# EAGLE design CAN-I2C (EAGLE 9.1.1)

## Sheet 1 of 2
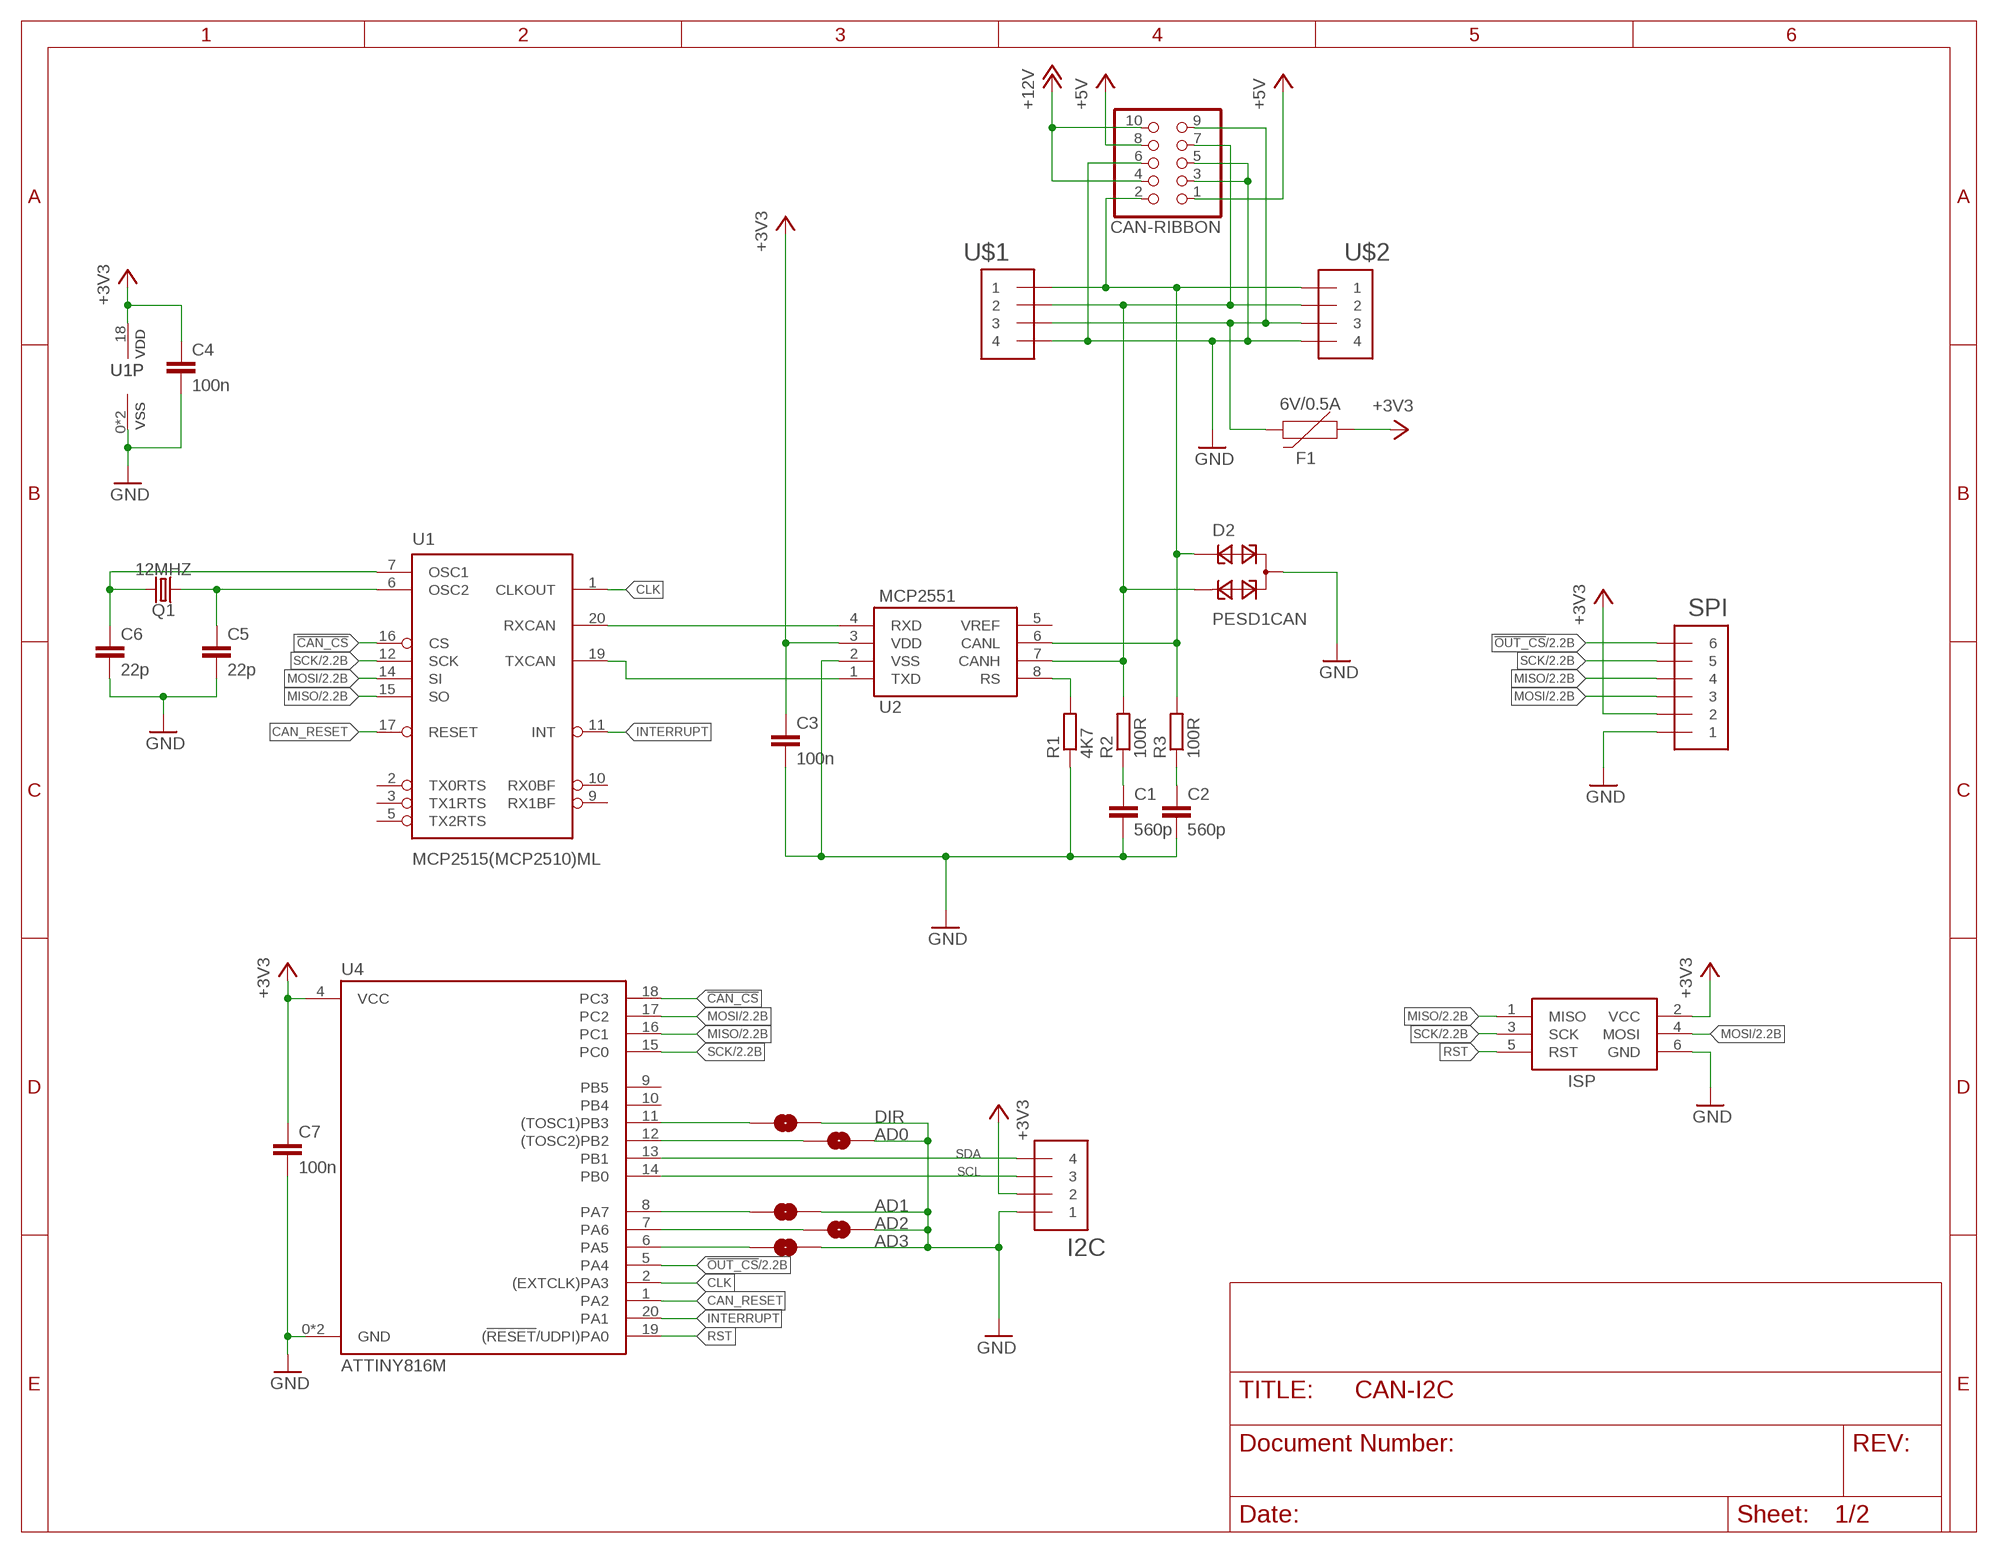
[diagram p0: schematic, sheet 1]

### Parts
AD0  JUMPER-SMT_2_NO_SILK  [SMT-JUMPER_2_NO_SILK]
AD1  JUMPER-SMT_2_NO_SILK  [SMT-JUMPER_2_NO_SILK]
AD2  JUMPER-SMT_2_NO_SILK  [SMT-JUMPER_2_NO_SILK]
AD3  JUMPER-SMT_2_NO_SILK  [SMT-JUMPER_2_NO_SILK]
C1  560p  C-EUC0603  [C0603]
C2  560p  C-EUC0603  [C0603]
C3  100n  C-EUC0603  [C0603]
C4  100n  C-EUC0603  [C0603]
C5  22p  C-EUC0603  [C0603]
C6  22p  C-EUC0603  [C0603]
C7  100n  C-EUC0603  [C0603]
CAN-RIBBON  PINHD-2X5_2.54-SMD  [2X05SMD]
D2  PESD1CAN  [SOT23]
DIR  JUMPER-SMT_2_NO_SILK  [SMT-JUMPER_2_NO_SILK]
F1  6V/0.5A  PPTC_HALF-AMP  [1206]
I2C  STRAWSON_EAGLE_LIB_JST_SH_4  [STRAWSON_EAGLE_LIB_JST_SH_4_SMD]
ISP  AVRISP-6  [AVRISP]
Q1  12MHZ  CRYSTALSMD-3.2X1.5  [CRYSTAL-SMD-3.2X1.5MM]
R1  4K7  R-EU_R0603  [R0603]
R2  100R  R-EU_R0603  [R0603]
R3  100R  R-EU_R0603  [R0603]
SPI  STRAWSON_EAGLE_LIB_JST_SH_6  [STRAWSON_EAGLE_LIB_JST_SH_6]
U1  MCP2515(MCP2510)ML  [QFN20]
U2  MCP2551  [SO08]
U4  ATTINY816M  [QFN20]
U$1  STRAWSON_EAGLE_LIB_JST_SH_4  [STRAWSON_EAGLE_LIB_JST_SH_4_SMD]
U$2  STRAWSON_EAGLE_LIB_JST_SH_4  [STRAWSON_EAGLE_LIB_JST_SH_4_SMD]

### Nets
!CAN_CS!: U1.16(CS) U4.18(PC3)
!OUT_CS!: SPI.6 U4.5(PA4) ; also sheet 2
+3V3: C3.1 C4.1 C7.1 F1.1 I2C.2 ISP.2(VCC) SPI.2 U1.18(VDD) U2.3(VDD) U4.4(VCC) ; also sheet 2
+5V: CAN-RIBBON.1 CAN-RIBBON.8 ; also sheet 2
+12V: CAN-RIBBON.4 CAN-RIBBON.10 ; also sheet 2
CAN_RESET: U1.17(RESET) U4.1(PA2)
CLK: U1.1(CLKOUT) U4.2((EXTCLK)PA3)
GND: AD0.2 AD1.2 AD2.2 AD3.2 C1.2 C2.2 C3.2 C4.2 C5.2 C6.2 C7.2 CAN-RIBBON.3 CAN-RIBBON.5 CAN-RIBBON.6 D2.3 DIR.2 I2C.1 ISP.6(GND) R1.1 SPI.1 U1.0(VSS) U1.8(VSS) U2.2(VSS) U4.0(GND) U4.3(GND) U$1.4 U$2.4 ; also sheet 2
INTERRUPT: U1.11(INT) U4.20(PA1)
MISO: ISP.1(MISO) SPI.4 U1.15(SO) U4.16(PC1) ; also sheet 2
MOSI: ISP.4(MOSI) SPI.3 U1.14(SI) U4.17(PC2) ; also sheet 2
N$1: U1.20(RXCAN) U2.4(RXD)
N$2: U1.19(TXCAN) U2.1(TXD)
N$3: R1.2 U2.8(RS)
N$4: CAN-RIBBON.7 D2.2 R2.2 U2.7(CANH) U$1.2 U$2.2
N$5: CAN-RIBBON.2 D2.1 R3.2 U2.6(CANL) U$1.1 U$2.1
N$6: C1.1 R2.1
N$7: C2.1 R3.1
N$8: AD1.1 U4.8(PA7)
N$9: DIR.1 U4.11((TOSC1)PB3)
N$10: C6.1 Q1.P$2 U1.7(OSC1)
N$11: C5.1 Q1.P$1 U1.6(OSC2)
N$12: AD0.1 U4.12((TOSC2)PB2)
N$13: CAN-RIBBON.9 F1.2 U$1.3 U$2.3
N$14: AD2.1 U4.7(PA6)
N$15: AD3.1 U4.6(PA5)
RST: ISP.5(RST) U4.19((!RESET!/UDPI)PA0)
SCK: ISP.3(SCK) SPI.5 U1.12(SCK) U4.15(PC0) ; also sheet 2
SCL: I2C.3 U4.14(PB0) ; also sheet 2
SDA: I2C.4 U4.13(PB1) ; also sheet 2
Unconnected: U1.2(TX0RTS) U1.3(TX1RTS) U1.5(TX2RTS) U1.9(RX1BF) U1.10(RX0BF) U2.5(VREF) U4.9(PB5) U4.10(PB4)

## Sheet 2 of 2
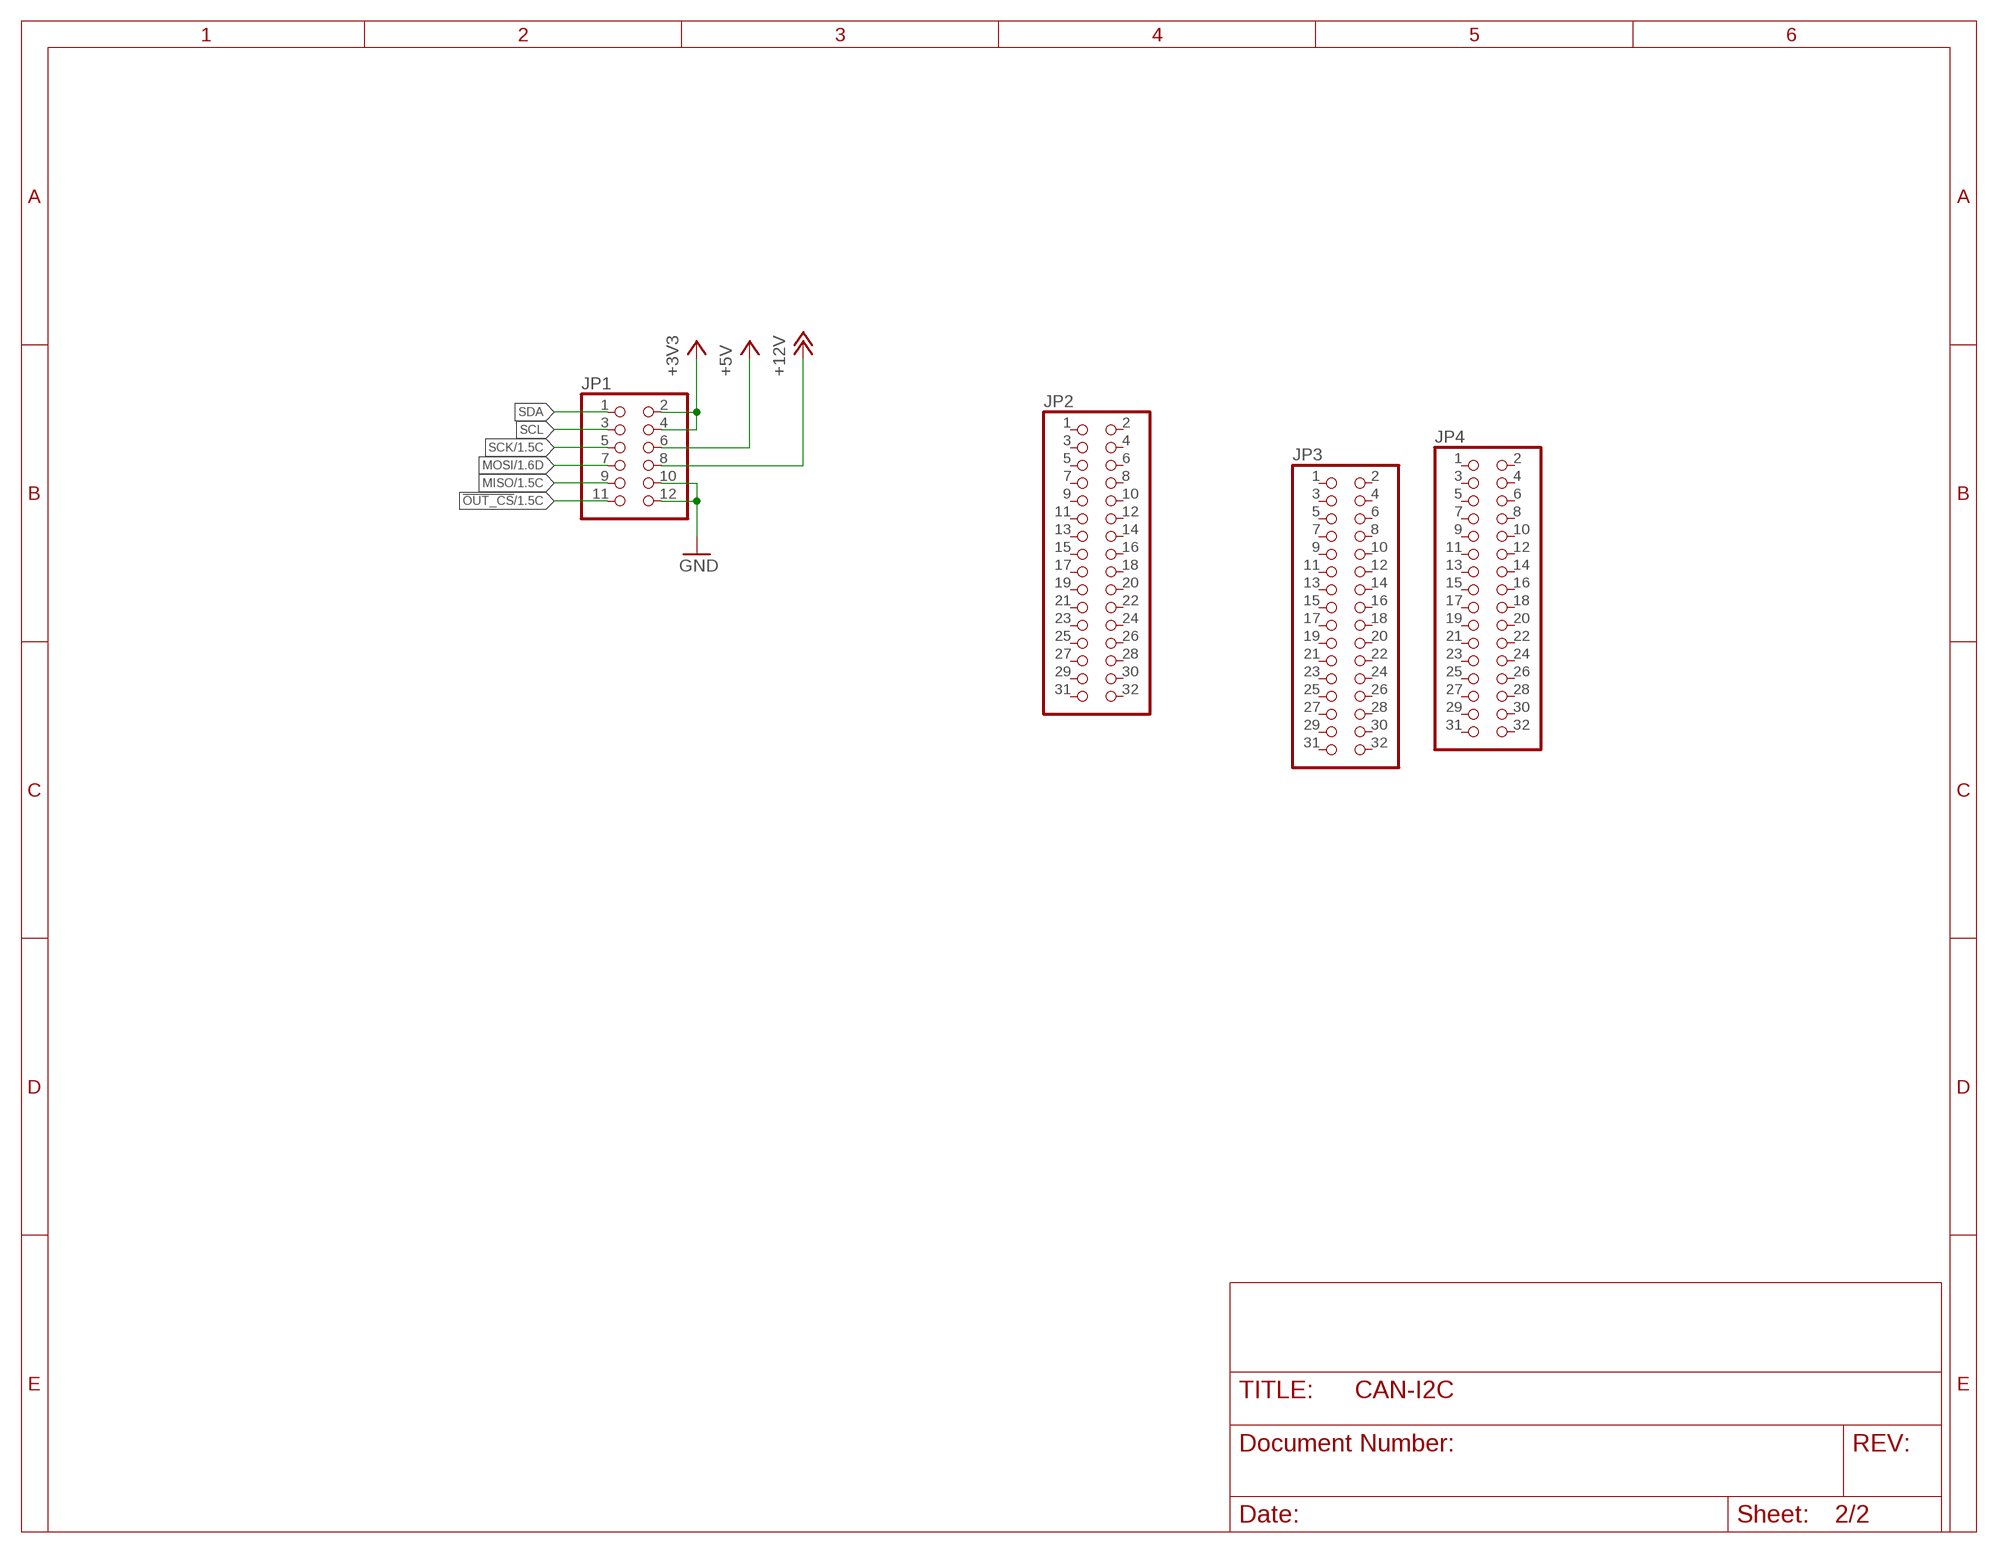
[diagram p1: schematic, sheet 2]

### Parts
JP1  PINHD-2X6  [2X06]
JP2  PINHD-2X16  [2X16]
JP3  PINHD-2X16  [2X16]
JP4  PINHD-2X16  [2X16]

### Nets
!OUT_CS!: JP1.11 ; also sheet 1
+3V3: JP1.2 JP1.4 ; also sheet 1
+5V: JP1.6 ; also sheet 1
+12V: JP1.8 ; also sheet 1
GND: JP1.10 JP1.12 ; also sheet 1
MISO: JP1.9 ; also sheet 1
MOSI: JP1.7 ; also sheet 1
SCK: JP1.5 ; also sheet 1
SCL: JP1.3 ; also sheet 1
SDA: JP1.1 ; also sheet 1
Unconnected: JP2.1 JP2.2 JP2.3 JP2.4 JP2.5 JP2.6 JP2.7 JP2.8 JP2.9 JP2.10 JP2.11 JP2.12 JP2.13 JP2.14 JP2.15 JP2.16 JP2.17 JP2.18 JP2.19 JP2.20 JP2.21 JP2.22 JP2.23 JP2.24 JP2.25 JP2.26 JP2.27 JP2.28 JP2.29 JP2.30 JP2.31 JP2.32 JP3.1 JP3.2 JP3.3 JP3.4 JP3.5 JP3.6 JP3.7 JP3.8 JP3.9 JP3.10 JP3.11 JP3.12 JP3.13 JP3.14 JP3.15 JP3.16 JP3.17 JP3.18 JP3.19 JP3.20 JP3.21 JP3.22 JP3.23 JP3.24 JP3.25 JP3.26 JP3.27 JP3.28 JP3.29 JP3.30 JP3.31 JP3.32 JP4.1 JP4.2 JP4.3 JP4.4 JP4.5 JP4.6 JP4.7 JP4.8 JP4.9 JP4.10 JP4.11 JP4.12 JP4.13 JP4.14 JP4.15 JP4.16 JP4.17 JP4.18 JP4.19 JP4.20 JP4.21 JP4.22 JP4.23 JP4.24 JP4.25 JP4.26 JP4.27 JP4.28 JP4.29 JP4.30 JP4.31 JP4.32

## Library data of the parts
AD0 AD1-AD3 DIR = SparkFun-Jumpers:JUMPER-SMT_2_NO: Normally open jumper This jumper has two pads in close proximity to each other. Apply solder to close the connection. Round pads are easier to solder for beginners, but are a lot larger. SparkFun Product that uses the round pads: SparkFun EL Sequencer <https://www.sparkfun.com/products/12781>
C1-C7 = resistor:C-EU: CAPACITOR, European symbol
CAN-RIBBON = pinhead-1:PINHD-2X5: PIN HEADER
D2 = diode:PESD1CAN: CAN bus ESD protection diode Source: http://www.nxp.com/documents/data_sheet/PESD1CAN.pdf
F1 = SparkFun-Fuses:PPTC: Resettable Fuse PPTC Resettable Fuse. Really a sort of resistor with a polymeric positive temperature coefficient whose resistance increases dramatically with an increase in temperature. When heated by the power passing through the resistance rises causing the current to be limited, protecting the circuit. This is achieved by the transition of the polymer from a crystalline to an amorphous state where the conductive carbon separates breaking the conductive pathways found in the cool crystalline structure. When a PPTC cools back down it resumes conducting letting the circuit turn back on. SparkFun Products: SparkFun RedBoard - Programmed with Arduino <https://www.sparkfun.com/products/12757> Pro Micro - 5V/16MHz <https://www.sparkfun.com/products/12640> Arduino Pro 328 - 5V/16MHz <https://www.sparkfun.com/products/10915> MP3 Trigger <https://www.sparkfun.com/products/13720>; PROD_ID: RES-08585
I2C U$1 U$2 = can-library:STRAWSON_EAGLE_LIB_JST_SH_4
ISP = adafruit:AVRISP: AVR ISP HEADER Standard 6 pin header for AVR programming
JP1 = pinhead:PINHD-2X6: PIN HEADER
JP2-JP4 = pinhead:PINHD-2X16: PIN HEADER
Q1 = SparkFun-Clocks:CRYSTAL: Crystals (Generic) These are passive quartz crystals, which can be used as a clock source for a microcontroller. Crystal's are two-terminal devices. They require external "load" capacitors to generate an oscillating signal.
R1-R3 = resistor:R-EU_: RESISTOR, European symbol
SPI = can-library:STRAWSON_EAGLE_LIB_JST_SH_6
U1 = can-library:MCP2515(MCP2510): CAN controller with SPI interface The MCP2515 controller supercedes the MCP2510 while addressing all errata associated with it. The two devices are pin compatible, either can be used with this device. 18-pin package SOIC Simple SPI interface to any MCU. One-shot mode ensures message transmission is attempted only once Databyte filtering Start-of-Frame (SOF) output Low-power CMOS Technology Datasheet <http://www.sparkfun.com/datasheets/DevTools/Arduino/MCP2515.pdf> SparkFun Products CAN-BUS Shield <https://www.sparkfun.com/products/13262> (DEV-13262)
U2 = SparkFun-IC-Comms:MCP2551: MCP2551 High Speed CAN Transceiver High speed CAN transceiver Datasheet <http://www.sparkfun.com/datasheets/DevTools/Arduino/MCP2551.pdf> SparkFun Products CAN-BUS Shield <https://www.sparkfun.com/products/13262> (DEV-13262) SparkFun OBD-II UART <https://www.sparkfun.com/products/9555> (WIG-09555); PROD_ID: IC-09907
U4 = can-library:ATTINY816

## Board
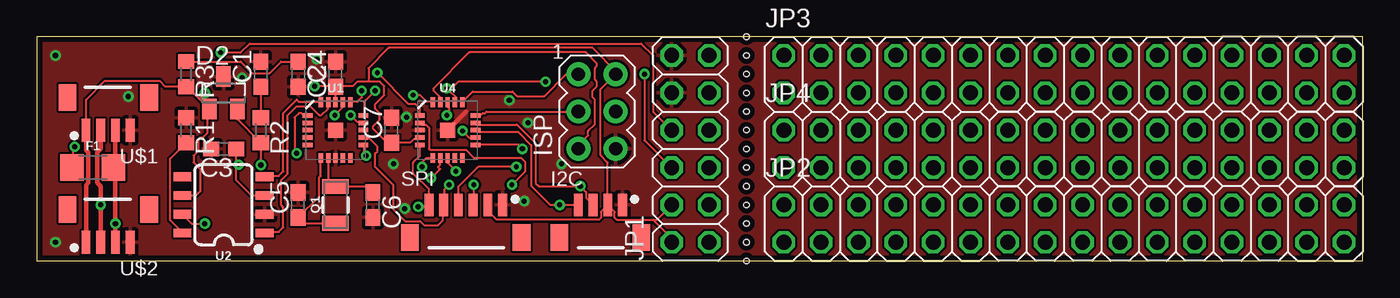
[diagram p2: board, top side]
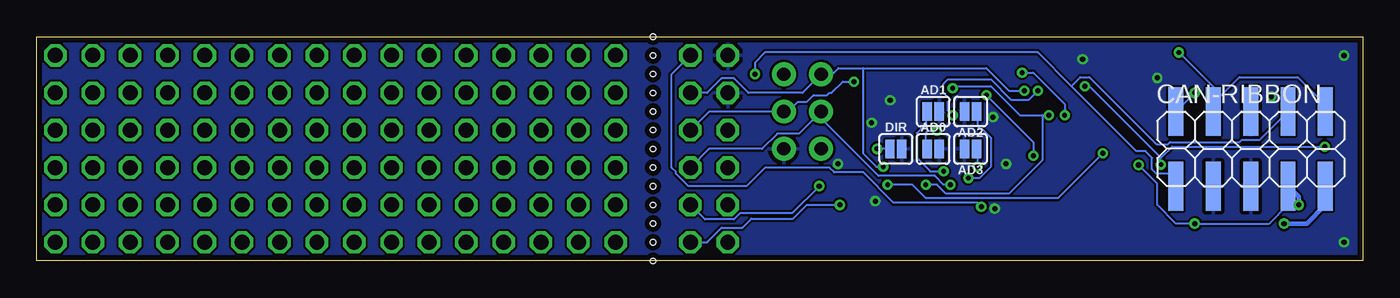
[diagram p3: board, bottom side, seen from below]

Size 90.17 x 15.24 mm. Coordinates in mm from the lower left corner, seen from the top.
Outline: 0,0 90.17,0 90.17,15.24 0,15.24 0,0
Copper layers (1*16): Top 0.0356mm / dielectric 1.5011mm / Bottom 0.0356mm
Design rules "LaenPCBOrder *": minimum track width 6mil, minimum drill 13mil, track to track 6mil, track to pad 6mil, pad to pad 6mil, via to via 6mil, smd to smd 6mil, copper to edge 15mil, drill to drill 6mil, minimum pad ring 7mil, minimum via ring 7mil, stop-mask expansion 4mil, vias tented up to drill 15mil, thermal gap 10mil
Holes 0.35 mm at 48.26,2.54 48.26,3.81 48.26,5.08 48.26,6.35 48.26,7.62 48.26,8.89 48.26,10.16 48.26,11.43 48.26,12.7 48.26,13.97 48.26,15.24 48.26,1.27 48.26,0

### Footprints (pad centres in the part's own frame; a part is rotated, then mirrored left to right if it is on the bottom)
SMT-JUMPER_2_NO_SILK = smd 0.635 x 1.27: 1 -0.406,0; 2 0.406,0
C0603 = smd 1.1 x 1: 1 -0.85,0; 2 0.85,0
2X05SMD = smd 1.016 x 3.302: 1 -1.27,-3.81; 2 -1.27,1.27; 3 1.27,-3.81; 4 1.27,1.27; 5 3.81,-3.81; 6 3.81,1.27; 7 6.35,-3.81; 8 6.35,1.27; 9 8.89,-3.81; 10 8.89,1.27
SOT23 = smd 1 x 1.4: 1 -0.95,-1.1; 2 0.95,-1.1; 3 0,1.1
1206 = smd 1.6 x 1.8: 1 -1.4,0; 2 1.4,0
STRAWSON_EAGLE_LIB_JST_SH_4_SMD = smd 0.6 x 1.55: 1 0.46,1.27; 2 -0.54,1.27; 3 -1.54,1.27; 4 -2.54,1.27 | smd 1.2 x 1.8: P$1 -3.84,-0.955; P$2 1.728,-0.955
AVRISP = drill 0.9 pad 1.626: 1 -1.27,2.54; 2 1.27,2.54; 3 -1.27,0; 4 1.27,0; 5 -1.27,-2.54; 6 1.27,-2.54
2X06 = drill 1.016 octagon: 1 -6.35,-1.27; 2 -6.35,1.27; 3 -3.81,-1.27; 4 -3.81,1.27; 5 -1.27,-1.27; 6 -1.27,1.27; 7 1.27,-1.27; 8 1.27,1.27; 9 3.81,-1.27; 10 3.81,1.27; 11 6.35,-1.27; 12 6.35,1.27
2X16 = drill 1.016 octagon: 1 -19.05,-1.27; 2 -19.05,1.27; 3 -16.51,-1.27; 4 -16.51,1.27; 5 -13.97,-1.27; 6 -13.97,1.27; 7 -11.43,-1.27; 8 -11.43,1.27; 9 -8.89,-1.27; 10 -8.89,1.27; 11 -6.35,-1.27; 12 -6.35,1.27; 13 -3.81,-1.27; 14 -3.81,1.27; 15 -1.27,-1.27; 16 -1.27,1.27; 17 1.27,-1.27; 18 1.27,1.27; 19 3.81,-1.27; 20 3.81,1.27; 21 6.35,-1.27; 22 6.35,1.27; 23 8.89,-1.27; 24 8.89,1.27; 25 11.43,-1.27; 26 11.43,1.27; 27 13.97,-1.27; 28 13.97,1.27; 29 16.51,-1.27; 30 16.51,1.27; 31 19.05,-1.27; 32 19.05,1.27
CRYSTAL-SMD-3.2X1.5MM = smd 1 x 1.8: P$1 -1.25,0; P$2 1.25,0
R0603 = smd 1 x 1.1: 1 -0.85,0; 2 0.85,0
STRAWSON_EAGLE_LIB_JST_SH_6 = smd 0.6 x 1.55: 1 5,0; 2 4,0; 3 3,0; 4 2,0; 5 1,0; 6 0,0 | smd 1.2 x 1.8: P$1 -1.3,-2.225; P$2 6.3,-2.225
QFN20 = smd 1 x 1: 0 0,0 | smd 0.65 x 0.3: 1 -1.9,1; 2 -1.9,0.5; 3 -1.9,0; 4 -1.9,-0.5; 5 -1.9,-1; 11 1.9,-1; 12 1.9,-0.5; 13 1.9,0; 14 1.9,0.5; 15 1.9,1 | smd 0.3 x 0.65: 6 -1,-1.9; 7 -0.5,-1.9; 8 0,-1.9; 9 0.5,-1.9; 10 1,-1.9; 16 1,1.9; 17 0.5,1.9; 18 0,1.9; 19 -0.5,1.9; 20 -1,1.9
SO08 = smd 0.6 x 1.2: 1 -1.905,-2.8; 2 -0.635,-2.8; 3 0.635,-2.8; 4 1.905,-2.8; 5 1.905,2.8; 6 0.635,2.8; 7 -0.635,2.8; 8 -1.905,2.8

### Placement (x,y rotation side)
AD0  29.21,7.62 0 bottom
AD1  29.21,10.16 0 bottom
AD2  26.67,10.16 180 bottom
AD3  26.67,7.62 180 bottom
C1  15.24,12.7 90 top
C2  17.78,12.7 270 top
C3  12.7,7.62 180 top
C4  20.32,12.7 90 top
C5  17.78,3.81 90 top
C6  22.86,3.81 270 top
C7  24.13,8.89 90 top
CAN-RIBBON  11.43,8.89 0 bottom
D2  12.7,11.43 0 top
DIR  31.75,7.62 0 bottom
F1  3.81,6.35 0 top
I2C  39.37,2.54 0 top
ISP  38.1,10.16 0 top
JP1  44.45,7.62 90 top
JP2  69.85,2.54 0 top
JP3  69.85,12.7 0 top
JP4  69.85,7.62 0 top
Q1  20.32,3.81 90 top
R1  10.16,8.89 270 top
R2  15.24,8.89 270 top
R3  10.16,12.7 270 top
SPI  26.67,3.81 0 top
U1  20.32,8.89 0 top
U2  12.7,3.81 90 top
U4  27.94,8.89 0 top
U$1  3.81,10.16 180 top
U$2  3.81,2.54 180 top

### Tracks (layer width: path | path; a pad name or v marks a point on that pad's centre or on a via)
!CAN_CS!  (via drill 0.33)
  Top 0.152: v22.1,11.58 22.1,11.12 21.79,10.82 21.34,10.82 U1.16 | v27.89,9.91 27.89,10.06 28.04,10.21 28.04,10.36 27.89,10.52 27.89,10.67 U4.18
  Bottom 0.152: v22.1,11.58 22.71,10.97 23.93,10.97 25.3,12.34 28.19,12.34 28.5,12.04 28.5,11.43 28.04,10.97 28.19,10.82 28.19,10.21 v27.89,9.91
!OUT_CS!  (via drill 0.35)
  Top 0.152: U4.5 26.06,7.77 26.06,7.16 25.6,6.71 25.6,5.94 26.67,4.88 SPI.6 26.55,3.69 v25.94,3.69
  Bottom 0.152: v25.94,3.69 26.22,3.96 31.9,3.96 33.96,6.02 35.93,6.02 36.26,6.35 40.64,6.35 41.91,5.08 45.85,5.08 46.71,5.94 46.71,6.07 46.99,6.35 46.99,12.7 JP1.11
+3V3  (via drill 0.33)
  Top 0.152: I2C.2 38.83,6.69 38.33,7.19 38.33,11.66 ISP.2 39.47,12.8 37.8,14.48 23.93,14.48 22.55,13.11 22.55,12.19 | SPI.2 30.67,3.41 31.01,3.07 | 31.01,3.07 31.27,2.81 | I2C.2 38.36,3.34 38.36,2.94 38.23,2.81 38.1,2.81 31.27,2.81 | 31.27,2.81 31.01,3.07 | U1.18 C4.1 | U4.4 25.92,8.27 25.62,8.27 25.39,8.04 C7.1 24.08,8.08 23.77,8.08 22.86,8.99 22.86,9.14 23.32,9.6 23.32,10.06 23.01,10.36 23.01,10.67 23.62,11.28 23.62,11.89 23.32,12.19 22.55,12.19 | I2C.2 39.3,3.34 39.3,2.94 39.44,2.81 41.91,2.81 | 13.56,6.55 13.56,5.49 14.63,4.42 15.39,4.42 U2.3 | 13.56,6.55 13.56,7.62 C3.1 | v2.59,7.77 2.44,7.62 2.44,6.4 F1.1 | 13.56,6.55 v13.72,6.55 | 22.55,12.19 21.79,12.19 21.49,11.89 20.42,11.89 C4.1 | v18.9,11.89 20.27,11.89 C4.1 | JP1.4 42.18,2.81 41.91,2.81 | 41.91,2.81 43.18,1.54 JP1.2
  Bottom 0.152: v2.59,7.77 12.95,7.77 13.72,7.01 | 13.72,7.01 13.87,6.86 13.87,6.71 v13.72,6.55 | 13.72,7.01 18.59,11.89 v18.9,11.89
+5V  (via drill 0.35)
  Top 0.152: v41.33,12.7 41.33,8.2 JP1.6
  Bottom 0.152: 19.81,11.89 15.39,7.47 14.78,7.47 14.33,7.01 14.33,6.25 14.02,5.94 13.26,5.94 12.8,5.49 12.8,5.18 CAN-RIBBON.1 | 19.81,11.89 22.1,14.17 40.64,14.17 41.33,13.48 v41.33,12.7 | 19.81,11.89 19.2,12.5 18.59,12.5 14.02,7.92 13.26,7.92 13.11,8.08 8.38,8.08 8.23,8.23 7.01,8.23 5.18,10.06 CAN-RIBBON.8
+12V  (via drill 0.33)
  Top 0.152: v12.5,14.17 13.87,14.17 14.48,14.78 41.1,14.78 41.91,13.97 41.91,10.16 JP1.8
  Bottom 0.152: v12.5,14.17 10.06,11.73 10.06,11.28 | 10.06,11.28 10.06,10.21 CAN-RIBBON.4 10.06,11.28 | 10.06,11.28 9.6,11.28 8.38,12.5 4.42,12.5 2.59,10.67 2.59,10.21 CAN-RIBBON.10
CAN_RESET  (via drill 0.33)
  Top 0.152: v20.27,9.91 20.88,10.52 20.88,10.67 U1.17 | v23.16,12.8 25.3,10.67 25.76,10.67 26.06,10.36 26.06,9.91 U4.1
  Bottom 0.152: v20.27,9.91 20.27,10.67 22.4,12.8 v23.16,12.8
CLK  (via drill 0.33)
  Top 0.152: v32.31,5.18 33.22,6.1 33.22,6.71 32.92,7.01 29.72,7.01 29.18,7.54 26.75,7.54 26.67,7.62 26.67,9.06 26.46,9.27 26.16,9.27 U4.2 | v17.68,7.32 17.53,7.47 17.53,9.75 17.83,10.06 17.98,10.06 18.14,9.91 18.29,9.91 U1.1
  Bottom 0.152: v32.31,5.18 30.63,5.18 29.72,4.27 20.73,4.27 v17.68,7.32
GND  (via drill 0.35)
  Top 0.305: U4.0 29.21,10.16
  other vias: 1.27,1.27 1.27,13.97 25.15,9.78 24.26,6.6 33.15,4.06 33.4,9.4 35.69,6.6 32.13,10.92 13.97,12.45 19.05,13.72 6.22,11.18 25.02,3.56
  pour Top: 0,0 91.44,0 91.44,16.51 0,16.51
  pour Bottom: 0,0 0,17.78 92.71,17.78 92.71,0
INTERRUPT  (via drill 0.33)
  Top 0.152: v22.4,7.16 22.25,7.32 22.25,7.77 U1.11 | v25.6,11.28 26.06,11.28 26.52,10.82 26.82,10.82 U4.20
  Bottom 0.152: v22.4,7.16 22.4,8.08 v25.6,11.28
MISO  (via drill 0.33)
  Top 0.152: v23.01,11.58 22.25,10.82 22.25,9.91 U1.15 | 28.96,10.82 U4.16 29.65,11.5 32.37,11.5 32.67,11.2 34.52,11.2 35.97,12.65 36.73,12.65 ISP.1 | v32.61,6.4 30.02,6.4 28.65,5.03 28.65,3.81 SPI.4
  Bottom 0.152: v23.01,11.58 24.08,11.58 25.6,13.11 33.98,13.11 | 33.98,13.11 35.66,13.11 35.97,12.8 36.73,12.8 ISP.1 38.1,11.43 41.78,11.43 42.77,12.42 43.59,12.42 44.58,11.43 JP1.9 | v32.61,6.4 33.07,6.4 33.98,7.32 33.98,13.11
MOSI  (via drill 0.33)
  Top 0.152: v21.34,9.91 21.79,9.45 22.1,9.45 U1.14 | 28.04,11.58 28.5,11.12 28.5,10.82 U4.17 | 28.04,11.58 v27.89,11.73 28.04,11.58 | v29.72,5.18 29.72,3.81 SPI.3 | 28.04,11.58 28.65,12.19 v34.59,12.19
  Bottom 0.152: 21.79,9.91 23.32,9.91 25.3,11.89 27.74,11.89 v27.89,11.73 | 21.79,9.91 v21.34,9.91 | v29.72,5.18 28.96,5.18 28.35,4.57 24.08,4.57 21.79,6.86 21.79,9.91 | v34.59,12.19 35.36,12.19 36.12,11.43 36.27,11.43 36.42,11.28 37.34,11.28 37.8,10.82 38.41,10.82 39.01,10.21 39.32,10.21 ISP.4 44.45,10.16 JP1.7
N$1
  Top 0.152: U1.20 19.2,10.82 17.83,10.82 17.68,10.97 16.76,10.06 16.76,6.1 16.46,5.79 15.54,5.79 U2.4
N$2
  Top 0.152: U1.19 19.81,10.67 19.81,10.36 19.36,9.91 19.2,9.91 18.59,10.52 17.68,10.52 17.07,9.91 17.07,5.94 16.61,5.49 16.61,3.81 16.76,3.66 16.76,2.29 16.46,1.98 15.54,1.98 U2.1
N$3
  Top 0.152: U2.8 9.9,1.95 9.07,2.78 9.07,6.95 R1.2
N$4  (via drill 0.35)
  Top 0.152: D2.2 13.65,9.63 R2.2 v15.24,6.52 | U2.7 10.54,2.54 v11.43,2.54
  Top 0.305: U$1.2 4.35,7.62 4.11,7.38 4.11,5.32 4.35,5.08 v4.35,3.81 U$2.2
  Bottom 0.152: CAN-RIBBON.7 5.08,3.81 6.35,2.54 v11.43,2.54 12.7,2.54 13.97,3.81 13.97,5.25 v15.24,6.52
  Bottom 0.305: CAN-RIBBON.7 4.35,4.35 v4.35,3.81
N$5  (via drill 0.35)
  Top 0.152: 11.04,11.04 D2.1 11.73,10.21 11.58,10.06 11.58,8.69 11.28,8.38 11.12,8.38 10.97,8.23 10.97,7.47 10.67,7.16 10.67,6.71 11.12,6.25 11.12,4.72 10.82,4.42 9.91,4.42 U2.6 | 11.04,11.04 10.23,11.85 R3.2 8.74,11.85 8.35,12.24 4.62,12.24 3.35,10.97 U$1.1 | v11.43,11.43 11.04,11.04
  Top 0.305: U$1.1 3.35,7.54 3.52,7.38 3.52,5.32 3.35,5.16 U$2.1
  Bottom 0.152: CAN-RIBBON.2 v11.43,11.43
N$6
  Top 0.152: C1.1 R2.1
N$7
  Top 0.152: R3.1 13.87,13.55 14.64,12.77 15.84,12.77 16.61,13.55 C2.1
N$8  (via drill 0.33)
  Top 0.152: v28.5,6.1 27.89,6.71 27.89,6.86 U4.8
  Bottom 0.152: v28.5,6.1 29.41,6.1 30.33,7.01 30.33,8.69 30.02,8.99 29.87,8.99 29.72,9.14 29.72,10.06 AD1.1
N$9  (via drill 0.35)
  Top 0.152: v33.02,7.62 32.75,7.89 U4.11
  Bottom 0.152: DIR.1 v33.02,7.62
N$10
  Top 0.152: C6.1 22.46,5.06 Q1.P$2 19.82,5.56 U1.7
N$11
  Top 0.152: Q1.P$1 18.18,2.56 C5.1 19.19,4.37 19.19,5.66 19.32,5.78 U1.6
N$12  (via drill 0.33)
  Top 0.152: v28.96,8.84 29.41,8.38 29.72,8.38 U4.12
  Bottom 0.152: v28.96,8.84 29.57,8.84 29.72,8.69 29.72,7.62 AD0.1
N$13  (via drill 0.35)
  Top 0.305: U$2.3 v5.35,2.54 5.35,6.21 | 5.35,6.21 F1.2 | U$1.3 5.35,6.21
  Bottom 0.305: CAN-RIBBON.9 2.54,3.81 3.81,2.54 v5.35,2.54
N$14  (via drill 0.33)
  Top 0.152: v26.82,5.64 27.43,6.25 27.28,6.4 27.43,6.55 27.43,6.86 U4.7
  Bottom 0.152: v26.82,5.64 26.06,5.64 25.3,6.4 25.3,8.38 25.91,8.99 26.06,8.99 26.21,9.14 26.21,10.06 AD2.1
N$15  (via drill 0.33)
  Top 0.152: v26.21,6.4 26.21,6.71 26.52,7.01 26.82,7.01 U4.6
  Bottom 0.152: v26.21,6.4 26.21,7.62 AD3.1
RST
  Top 0.152: U4.19 27.43,10.82 27.43,11.12 26.98,11.58 26.98,11.73 29.41,14.17 37.34,14.17 38.1,13.41 38.1,13.26 37.95,13.11 37.95,12.34 38.1,12.19 38.1,11.89 37.8,11.58 37.8,11.12 37.95,10.97 37.95,9.3 37.49,8.84 37.49,8.53 36.88,7.92 36.88,7.62 ISP.5
SCK  (via drill 0.33)
  Top 0.152: U4.15 29.87,9.91 30.18,9.91 30.33,10.06 30.48,10.06 30.58,10.16 ISP.3 | U1.12 22.25,8.38 22.55,8.38 23.16,7.77 23.16,7.47 23.01,7.32 23.01,6.4 24.23,5.18 24.23,3.52 25.04,2.71 26.07,2.71 26.34,2.44 27.28,2.44 27.58,2.74 27.58,3.81 SPI.5 27.74,3.81 27.74,4.88 v28.04,5.18
  Bottom 0.152: v28.04,5.18 28.5,5.18 29.11,5.79 32.92,5.79 37.03,9.91 ISP.3 38.33,8.66 39.8,8.66 40.84,7.62 44.45,7.62 JP1.5
SCL  (via drill 0.35)
  Top 0.152: U4.14 29.96,9.27 32.66,9.27 33.93,8 33.93,5.3 34.15,5.08 36.83,5.08 | I2C.3 37.36,4.28 37.36,4.68 v36.96,5.08 36.83,5.08 | v36.96,5.09 36.95,5.08 36.83,5.08
  Bottom 0.152: v36.96,5.09 38.8,3.24 42.34,3.24 42.77,2.82 44.73,2.82 JP1.3
SDA  (via drill 0.35)
  Top 0.152: I2C.4 v35.56,3.81 34.92,3.81 33.63,5.1 33.63,7.87 32.73,8.77 29.96,8.77 U4.13
  Bottom 0.152: JP1.1 44.58,1.27 43.59,2.26 42.19,2.26 41.58,2.87 38.74,2.87 37.81,3.81 v35.56,3.81